# EAGLE design 15V PS (EAGLE 9.2.0)

## Sheet 1 of 2

## Sheet 2 of 2
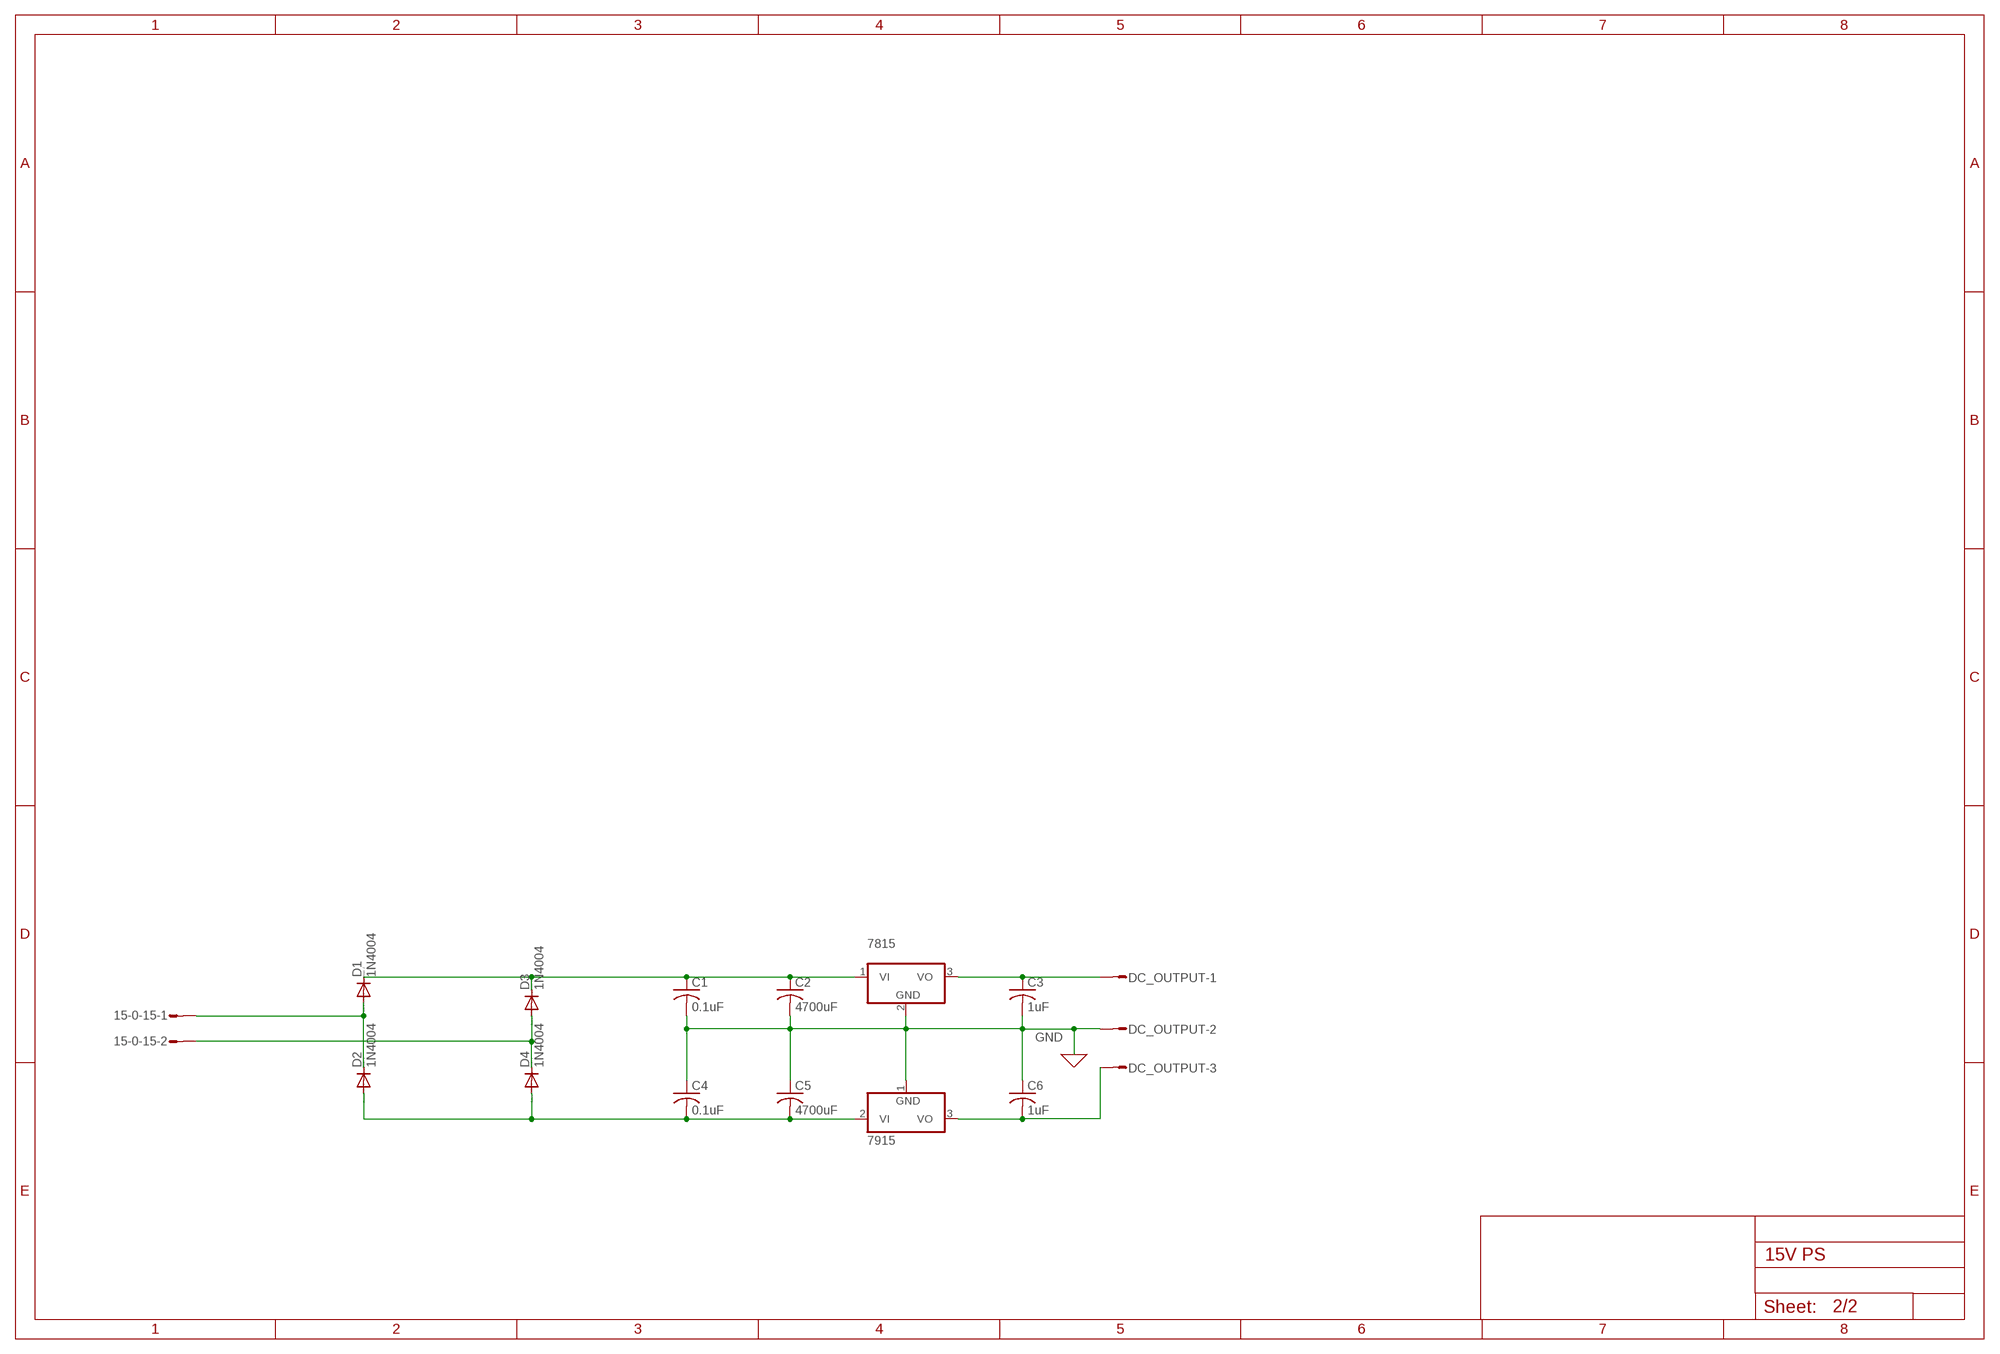
[diagram p0: schematic, sheet 2]

### Parts
15-0-15  L02P  [L02P]
7815  7815T  [TO220H]
7915  7915T  [TO220H]
C1  0.1uF  C-US025-024X044  [C025-024X044]
C2  4700uF  C-US025-024X044  [C025-024X044]
C3  1uF  C-US025-024X044  [C025-024X044]
C4  0.1uF  C-US025-024X044  [C025-024X044]
C5  4700uF  C-US025-024X044  [C025-024X044]
C6  1uF  C-US025-024X044  [C025-024X044]
D1  1N4004  [DO41-10]
D2  1N4004  [DO41-10]
D3  1N4004  [DO41-10]
D4  1N4004  [DO41-10]
DC_OUTPUT  L03P  [L03P]

### Nets
GND: 7815.2(GND) 7915.1(GND) C1.2 C2.2 C3.2 C4.1 C5.1 C6.1 DC_OUTPUT.2
N$2: 15-0-15.1 D1.A D2.C
N$3: 15-0-15.2 D3.A D4.C
N$4: 7915.2(VI) C4.2 C5.2 D2.A D4.A
N$5: 7815.1(VI) C1.1 C2.1 D1.C D3.C
N$10: 7915.3(VO) C6.2 DC_OUTPUT.3
N$11: 7815.3(VO) C3.1 DC_OUTPUT.1

## Library data of the parts
15-0-15 = con-amp-mt:L02P: AMP MT CONNECTOR; OC_FARNELL: unknown; OC_NEWARK: unknown
7815 = linear:78*: Positive VOLTAGE REGULATOR Source: http://cache.national.com/ds/LM/LM78L05.pdf http://www.fairchildsemi.com/ds/LM/LM7805.pdf
7915 = linear:79*: Negative VOLTAGE REGULATOR
C1-C6 = rcl:C-US: CAPACITOR, American symbol; SPICEPREFIX: C
D1-D4 = diode:1N4004: DIODE general purpose rectifier, 1 A
DC_OUTPUT = con-amp-mt:L03P: AMP MT CONNECTOR; OC_FARNELL: unknown; OC_NEWARK: unknown; SPICEPREFIX: X

## Board
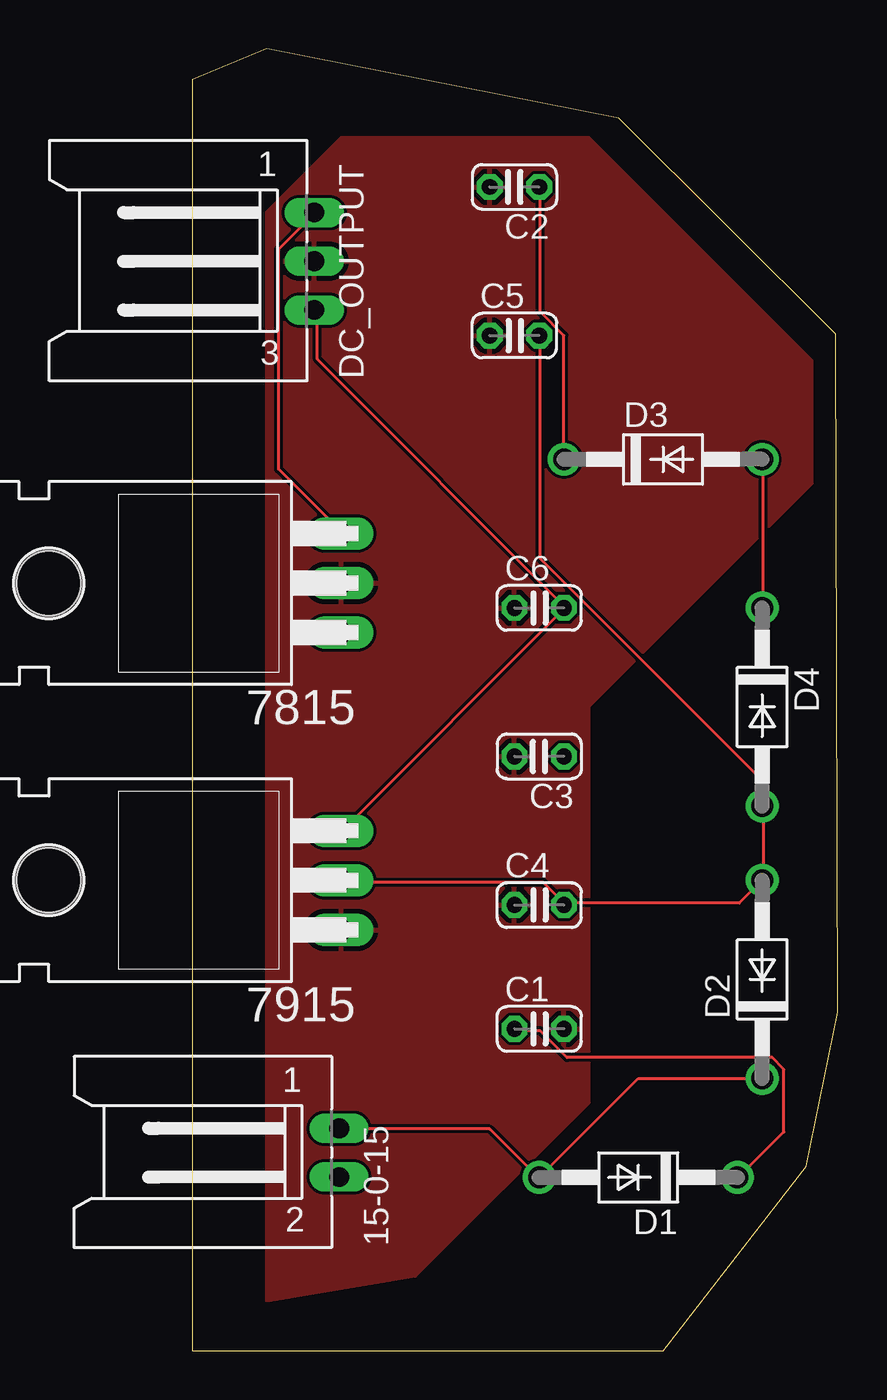
[diagram p1: board, top side]
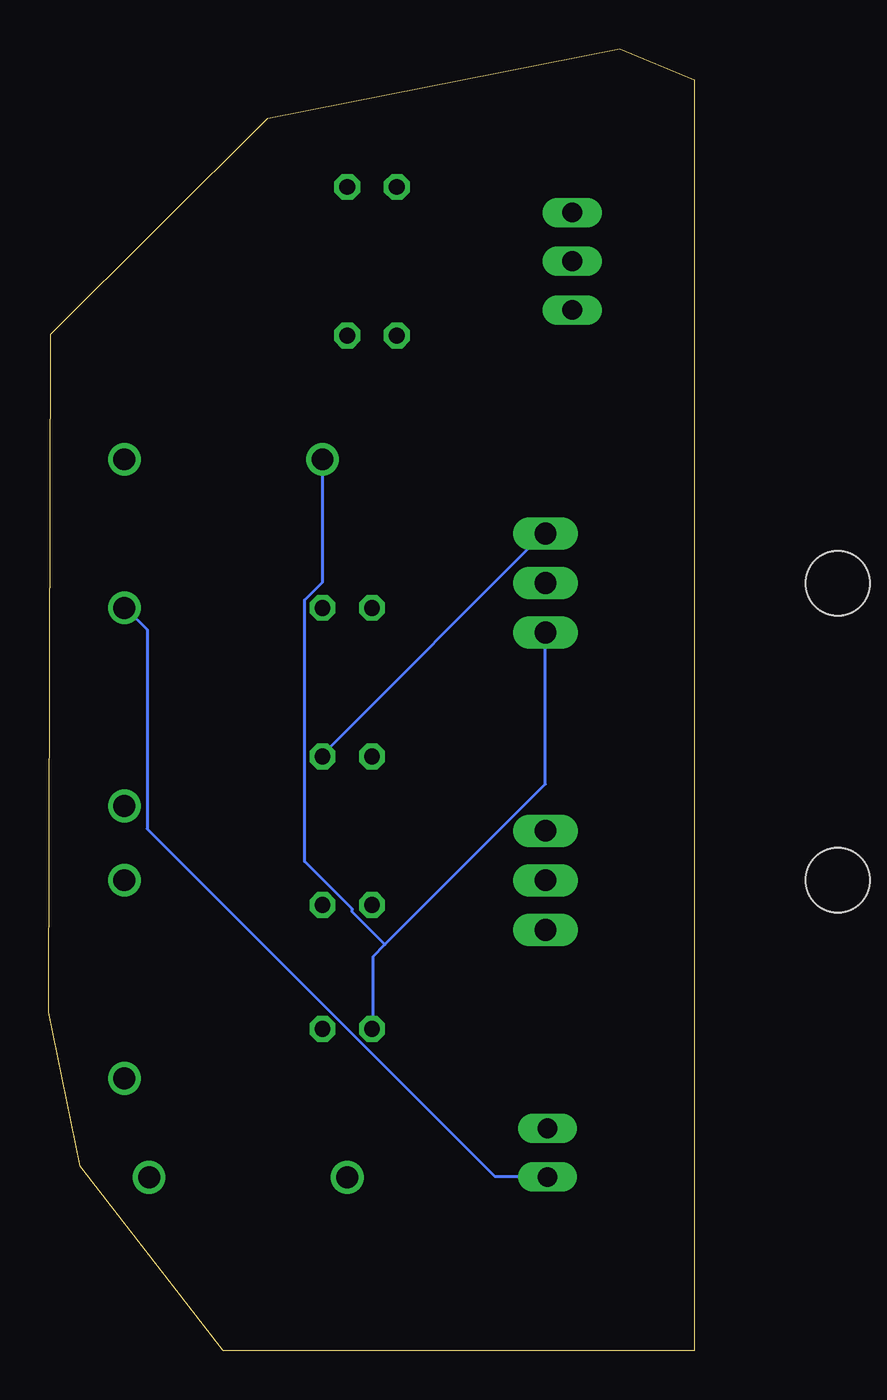
[diagram p2: board, bottom side, seen from below]

Size 33.09 x 66.78 mm. Coordinates in mm from the lower left corner, seen from the top.
Outline: 0,0 24.13,0 31.46,9.47 33.09,17.36 32.98,52.14 21.87,63.21 3.8,66.78 0,65.2 0,0
Copper layers (1*16): Top 0.035mm / dielectric 1.5mm / Bottom 0.035mm
Design rules "default": minimum track width 6mil, minimum drill 0.35mm, track to track 6mil, track to pad 6mil, pad to pad 6mil, via to via 6mil, smd to smd 6mil, copper to edge 40mil, drill to drill 6mil, minimum pad ring 10mil, minimum via ring 8mil, stop-mask expansion 4mil, vias tented up to drill 0mil, thermal gap 10mil

### Footprints (pad centres in the part's own frame; a part is rotated, then mirrored left to right if it is on the bottom)
L02P = drill 1.016 long: 1 1.25,-6.25; 2 -1.25,-6.25
TO220H = drill 1.118 long: 1 -2.54,-10.16; 2 0,-10.16; 3 2.54,-10.16 | hole 3.302: 0,4.826
C025-024X044 = drill 0.813 octagon: 1 -1.27,0; 2 1.27,0
DO41-10 = drill 1.118: A 5.08,0; C -5.08,0
L03P = drill 1.016 long: 1 2.5,-6.25; 2 0,-6.25; 3 -2.5,-6.25

### Placement (x,y rotation side)
15-0-15  1.27,10.16 90 top
7815  -2.54,39.37 90 top
7915  -2.54,24.13 90 top
C1  17.78,16.51 0 top
C2  16.51,59.69 180 top
C3  17.78,30.48 180 top
C4  17.78,22.86 0 top
C5  16.51,52.07 0 top
C6  17.78,38.1 0 top
D1  22.86,8.89 180 top
D2  29.21,19.05 90 top
D3  24.13,45.72 0 top
D4  29.21,33.02 270 top
DC_OUTPUT  0,55.88 90 top

### Tracks (layer width: path | path; a pad name or v marks a point on that pad's centre or on a via)
GND
  pour Top: 3.81,2.54 3.81,58.42 7.62,62.23 20.32,62.23 21.59,60.96 31.75,50.8 31.75,44.45 20.32,33.02 20.32,12.7 11.43,3.81
N$2
  Top 0.152: 15-0-15.1 7.62,11.38 15.24,11.38 17.68,8.94 D1.A 22.86,13.97 D2.C
N$3
  Top 0.152: D3.A 29.26,45.67 29.26,38.2 D4.C
  Bottom 0.152: 15-0-15.2 7.62,8.94 10.21,8.94 28.04,26.77 28.04,36.98 29.11,38.05 D4.C
N$4
  Top 0.152: 19.05,22.96 28.04,22.96 D2.A 29.26,24.18 29.26,27.84 D4.A 29.11,27.99 29.11,29.36 17.83,40.64 17.83,52.07 C5.2 | 19.05,22.96 17.98,24.03 7.62,24.03 7915.2 | 19.05,22.96 C4.2
N$5
  Top 0.152: D3.C 19.05,52.07 17.83,53.29 17.83,59.69 C2.1 | C1.1 16.61,16.41 17.83,16.41 19.2,15.04 29.72,15.04 30.33,14.43 30.33,11.23 28.04,8.94 D1.C
  Bottom 0.152: 7815.1 7.62,29.06 15.85,20.83 | 15.85,20.83 16.46,20.22 16.46,16.56 C1.1 | D3.C 19.05,39.42 19.96,38.51 19.96,25.09 17.53,22.66 17.53,22.5 15.85,20.83
N$10
  Top 0.152: 7915.3 7.62,26.62 19.05,38.05 C6.2 19.05,38.2 6.4,50.85 6.4,53.29 DC_OUTPUT.3
N$11
  Top 0.152: DC_OUTPUT.1 6.25,58.32 4.42,56.49 4.42,45.21 7.62,42.01 7815.3
  Bottom 0.152: C3.1 19.05,30.58 7.62,42.01 7815.3